# Altium schematic sheet StepTMC5160.SchDoc
size A2; SheetNumber: 1; SheetTotal: 1
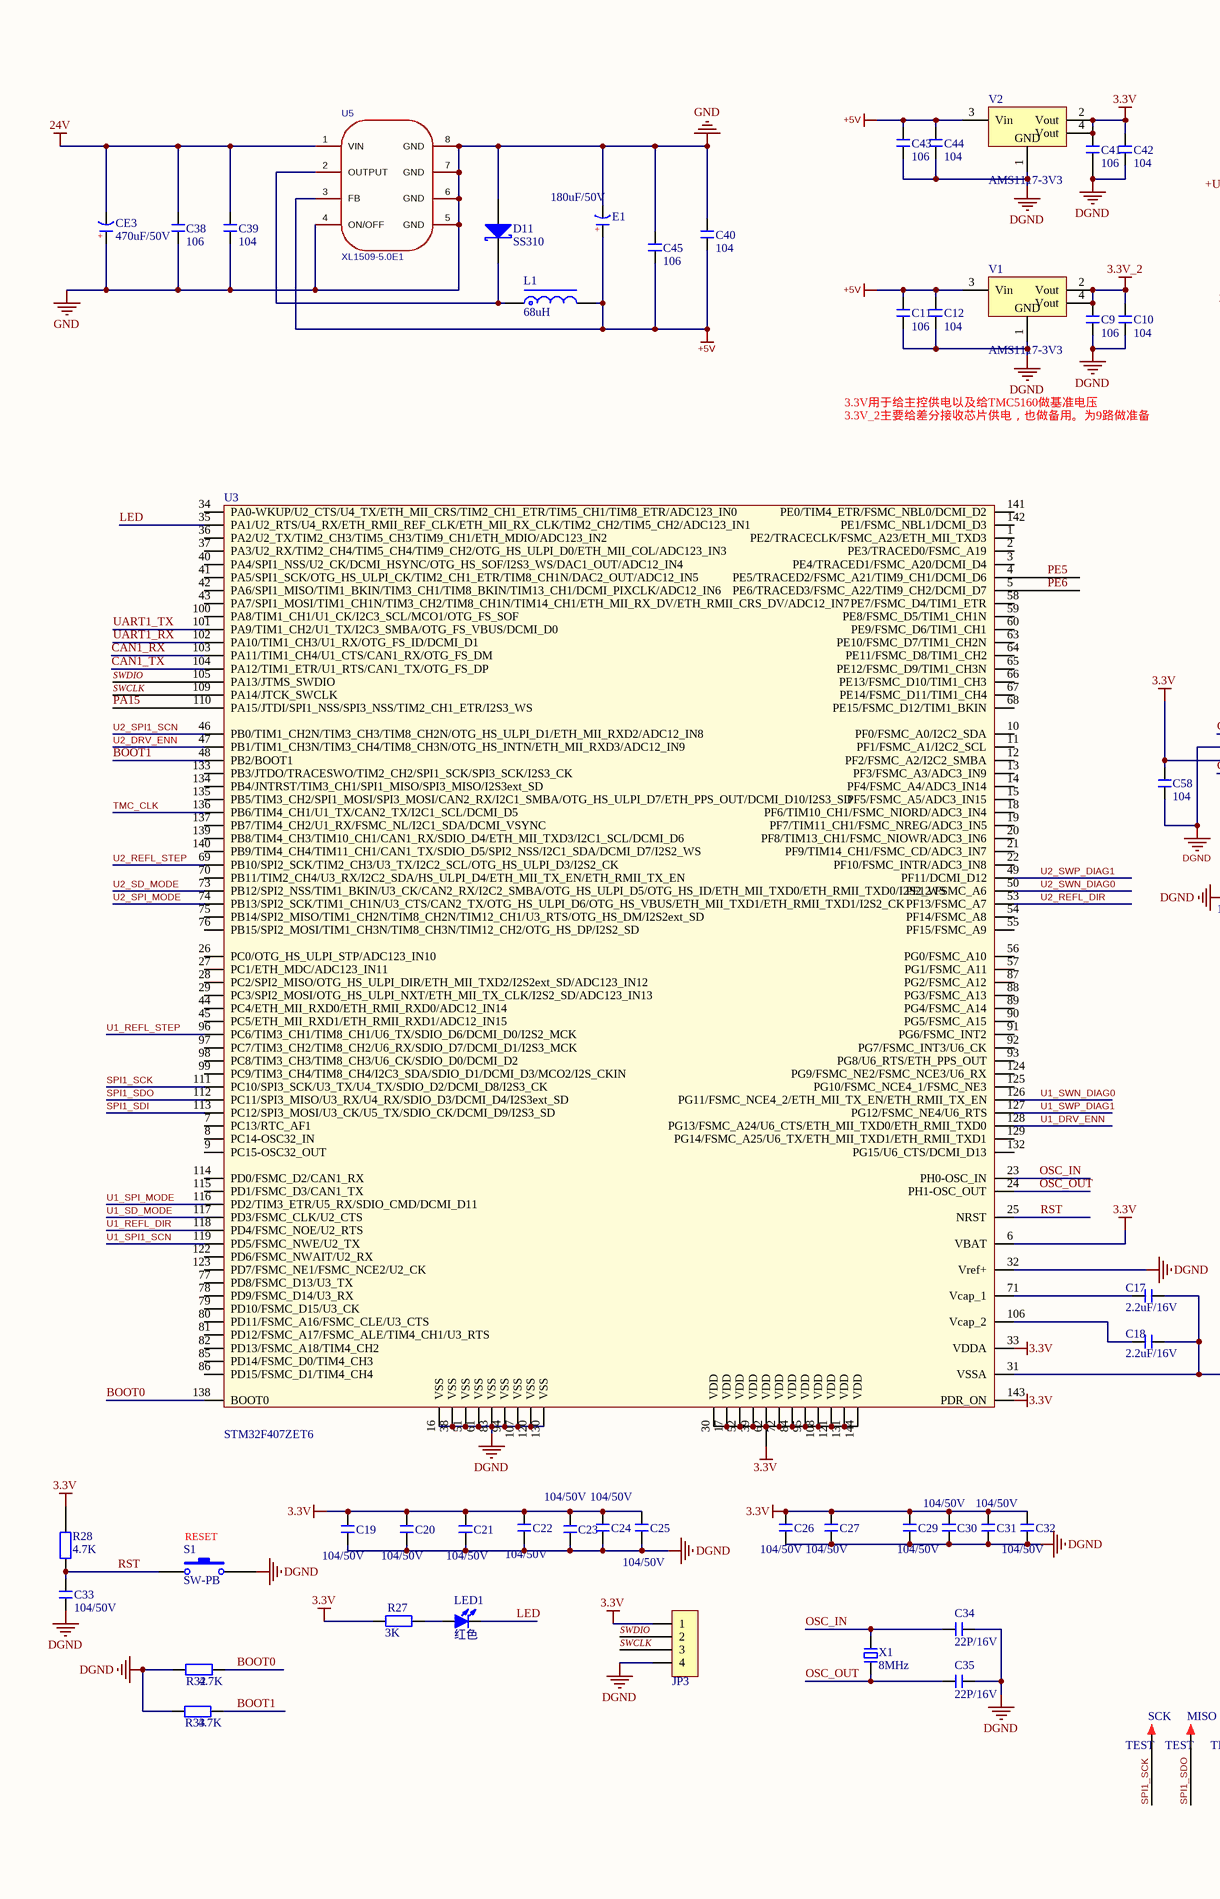
[diagram p0: StepTMC5160.SchDoc, left]
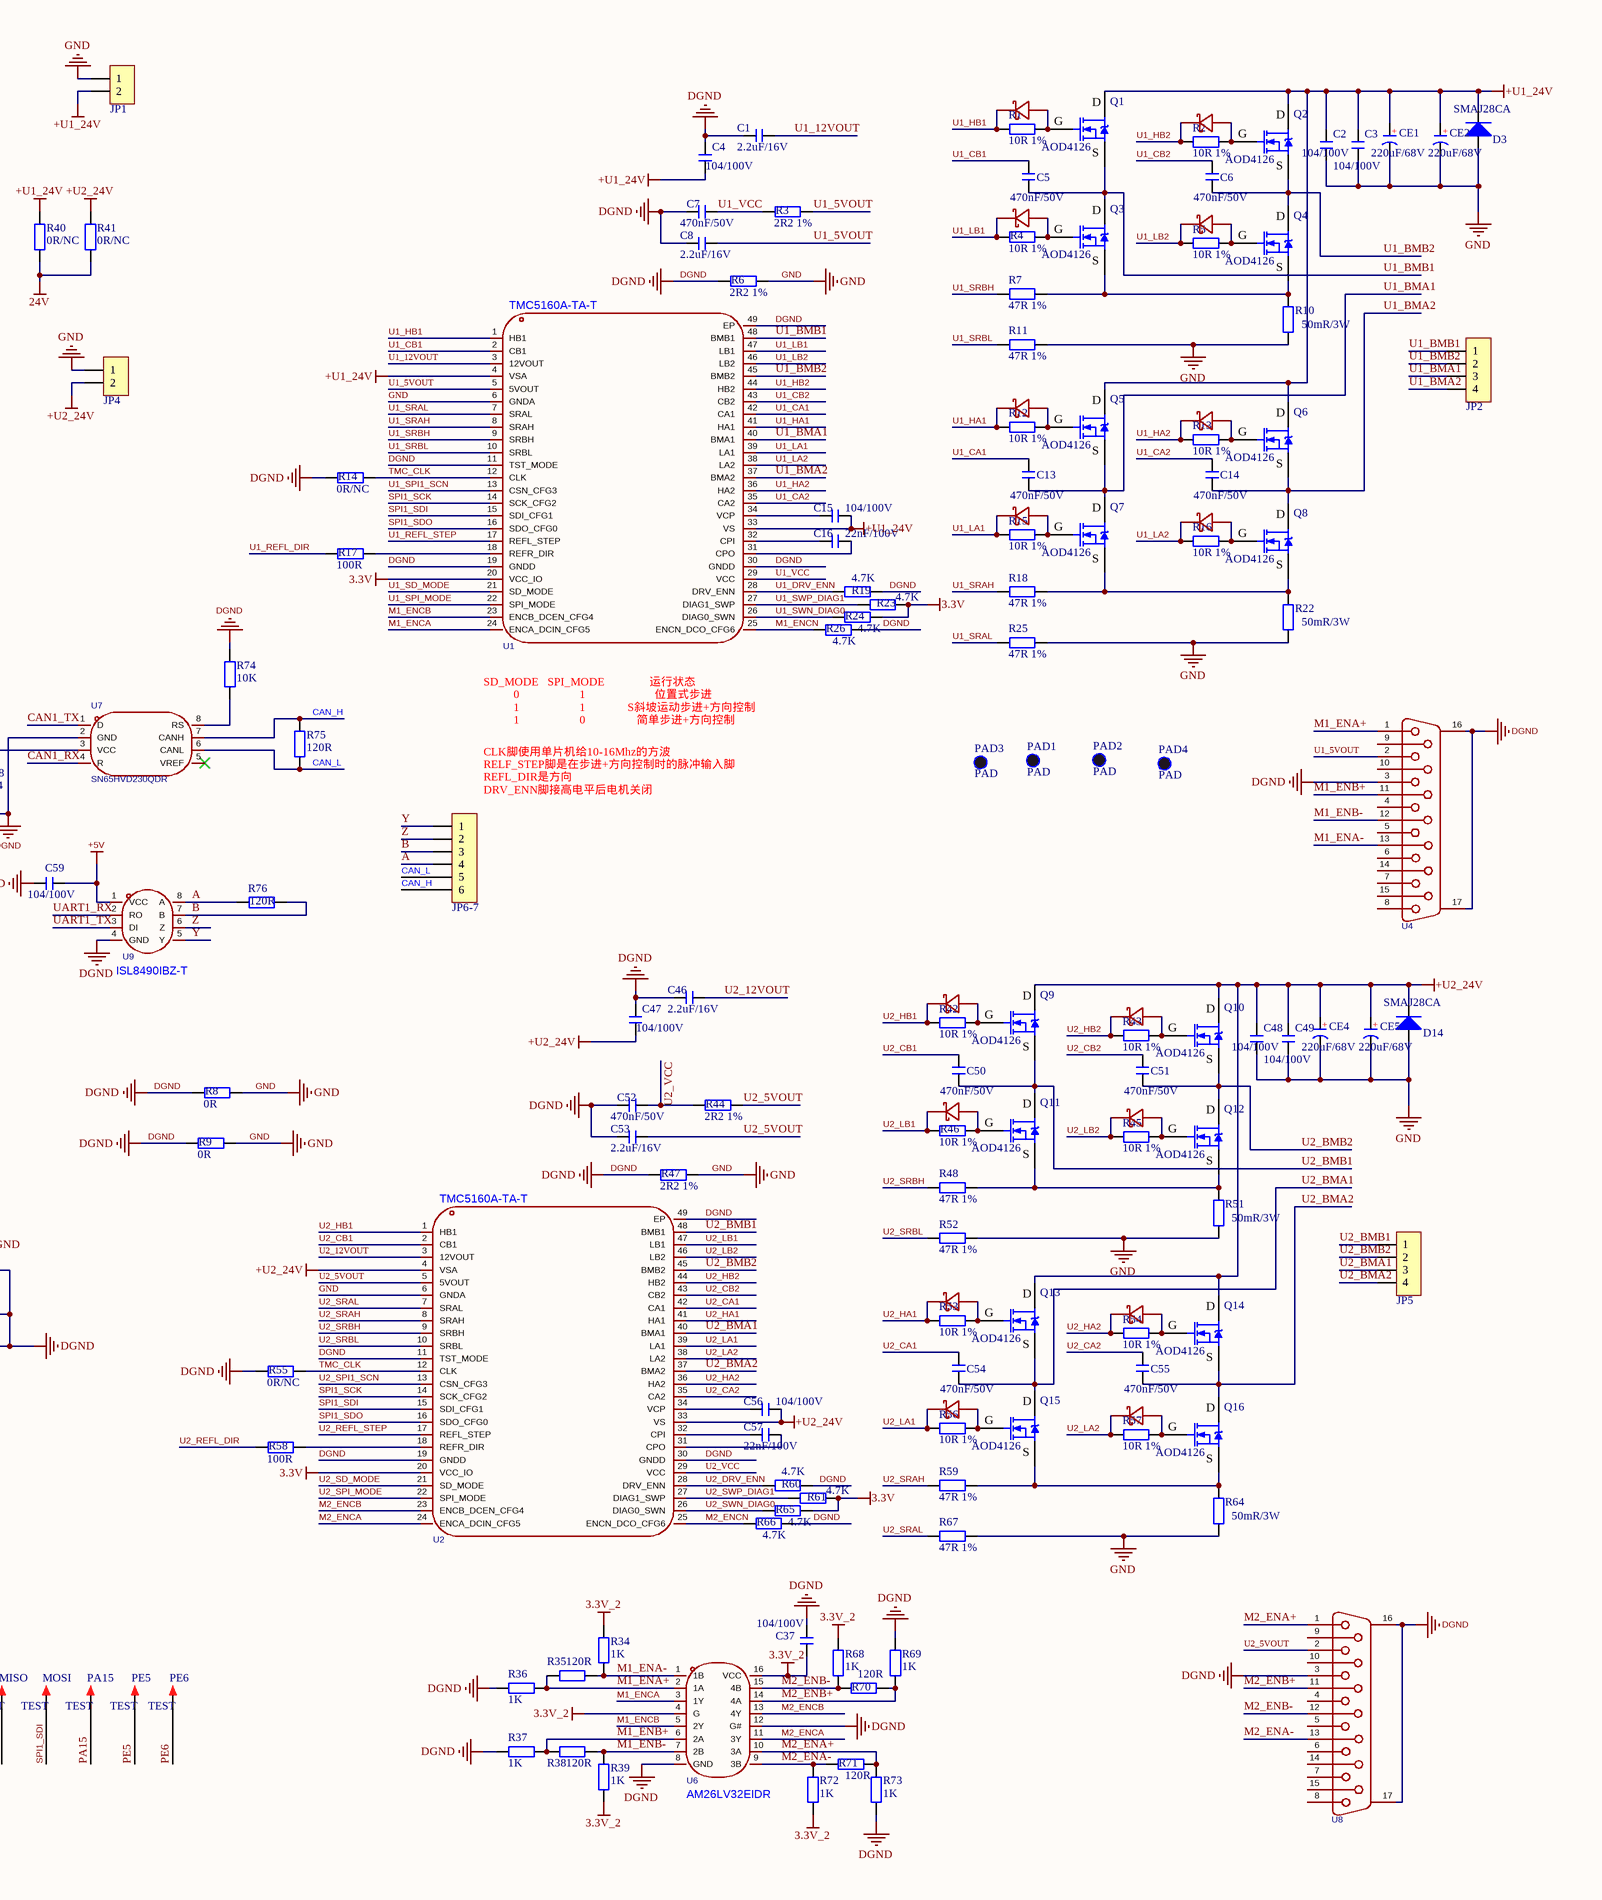
[diagram p1: StepTMC5160.SchDoc, right]

## Parts
C1  2.2uF/16V  [C 0603_L]
C2  104/100V  [C 0805_L]
C3  104/100V  [C 0805_L]
C4  104/100V  [C 0805_L]
C5  470nF/50V  [C 0603_L]
C6  470nF/50V  [C 0603_L]
C7  470nF/50V  [C 0603_L]
C8  2.2uF/16V  [C 0603_L]
C9  106  [C 0805_M]
C10  104  [C 0603_M]
C11  106  [C 0805_M]
C12  104  [C 0603_M]
C13  470nF/50V  [C 0603_L]
C14  470nF/50V  [C 0603_L]
C15  104/100V  [C 0805_L]
C16  22nF/100V  [C 0603_L]
C17  2.2uF/16V  [C 0603_L]
C18  2.2uF/16V  [C 0603_L]
C19  104/50V  [C 0603_L]
C20  104/50V  [C 0603_L]
C21  104/50V  [C 0603_L]
C22  104/50V  [C 0603_L]
C23  104/50V  [C 0603_L]
C24  104/50V  [C 0603_L]
C25  104/50V  [C 0603_L]
C26  104/50V  [C 0603_L]
C27  104/50V  [C 0603_L]
C29  104/50V  [C 0603_L]
C30  104/50V  [C 0603_L]
C31  104/50V  [C 0603_L]
C32  104/50V  [C 0603_L]
C33  104/50V  [C 0603_L]
C34  22P/16V  [C 0603_M]
C35  22P/16V  [C 0603_M]
C37  104/100V  [C 0805_L]
C38  106  [C 0805_M]
C39  104  [C 0603_M]
C40  104  [C 0603_M]
C41  106  [C 0805_M]
C42  104  [C 0603_M]
C43  106  [C 0805_M]
C44  104  [C 0603_M]
C45  106  [C 0805_M]
C46  2.2uF/16V  [C 0603_L]
C47  104/100V  [C 0805_L]
C48  104/100V  [C 0805_L]
C49  104/100V  [C 0805_L]
C50  470nF/50V  [C 0603_L]
C51  470nF/50V  [C 0603_L]
C52  470nF/50V  [C 0603_L]
C53  2.2uF/16V  [C 0603_L]
C54  470nF/50V  [C 0603_L]
C55  470nF/50V  [C 0603_L]
C56  104/100V  [C 0805_L]
C57  22nF/100V  [C 0603_L]
C58  104  [C 0603_L]
C59  104/100V  [C 0805_L]
CE1  220uF/68V  [CAP 5.0*10*12.5 - BK]
CE2  220uF/68V  [CAP 5.0*10*12.5 - BK]
CE3  470uF/50V  [CAP 5.0*10*20]
CE4  220uF/68V  [CAP 5.0*10*12.5 - BK]
CE5  220uF/68V  [CAP 5.0*10*12.5 - BK]
D1  1N4148W_C7420318  [SOD-123]  (value not drawn)
D2  1N4148W_C7420318  [SOD-123]  (value not drawn)
D3  SMAJ28CA  [DIODE-SMB]
D4  1N4148W_C7420318  [SOD-123]  (value not drawn)
D5  1N4148W_C7420318  [SOD-123]  (value not drawn)
D6  1N4148W_C7420318  [SOD-123]  (value not drawn)
D7  1N4148W_C7420318  [SOD-123]  (value not drawn)
D8  1N4148W_C7420318  [SOD-123]  (value not drawn)
D9  1N4148W_C7420318  [SOD-123]  (value not drawn)
D11  SS310  [SMA]
D12  1N4148W_C7420318  [SOD-123]  (value not drawn)
D13  1N4148W_C7420318  [SOD-123]  (value not drawn)
D14  SMAJ28CA  [DIODE-SMB]
D15  1N4148W_C7420318  [SOD-123]  (value not drawn)
D16  1N4148W_C7420318  [SOD-123]  (value not drawn)
D17  1N4148W_C7420318  [SOD-123]  (value not drawn)
D18  1N4148W_C7420318  [SOD-123]  (value not drawn)
D19  1N4148W_C7420318  [SOD-123]  (value not drawn)
D20  1N4148W_C7420318  [SOD-123]  (value not drawn)
E1  180uF/50V  [CM E(8*10.2)]
JP1  HDR-1X2  [VH3.96-LI-2P]  (value not drawn)
JP2  HDR-1X4  [KF350-4P]  (value not drawn)
JP3  HDR-1X4  [HDR2.54-LI-4P]  (value not drawn)
JP4  HDR-1X2  [VH3.96-LI-2P]  (value not drawn)
JP5  HDR-1X4  [KF350-4P]  (value not drawn)
JP6-7  HDR-1X6  [XH2.54-LI-6P]  (value not drawn)
L1  68uH  [IND-SMD_L5.7-W5.2_GSM0530]
LED1  红色  [LED 0805G]
MISO  TEST  [TEST 1.6]
MOSI  TEST  [TEST 1.6]
PA15  TEST  [TEST 1.6]
PAD1  PAD  [PAD_3.0]
PAD2  PAD  [PAD_3.0]
PAD3  PAD  [PAD_3.0]
PAD4  PAD  [PAD_3.0]
PE5  TEST  [TEST 1.6]
PE6  TEST  [TEST 1.6]
Q1  AOD4126  [TO252]
Q2  AOD4126  [TO252]
Q3  AOD4126  [TO252]
Q4  AOD4126  [TO252]
Q5  AOD4126  [TO252]
Q6  AOD4126  [TO252]
Q7  AOD4126  [TO252]
Q8  AOD4126  [TO252]
Q9  AOD4126  [TO252]
Q10  AOD4126  [TO252]
Q11  AOD4126  [TO252]
Q12  AOD4126  [TO252]
Q13  AOD4126  [TO252]
Q14  AOD4126  [TO252]
Q15  AOD4126  [TO252]
Q16  AOD4126  [TO252]
R1  10R 1%  [R 0603_L]
R2  10R 1%  [R 0603_L]
R3  2R2 1%  [R 0603_L]
R4  10R 1%  [R 0603_L]
R5  10R 1%  [R 0603_L]
R6  2R2 1%  [R 0603_L]
R7  47R 1%  [R 0603_L]
R8  0R  [R 2512_L]
R9  0R  [R 2512_L]
R10  50mR/3W  [R 2512_L]
R11  47R 1%  [R 0603_L]
R12  10R 1%  [R 0603_L]
R13  10R 1%  [R 0603_L]
R14  0R/NC  [R 0603_L]
R15  10R 1%  [R 0603_L]
R16  10R 1%  [R 0603_L]
R17  100R  [R 0603_L]
R18  47R 1%  [R 0603_L]
R19  4.7K  [R 0603_L]
R22  50mR/3W  [R 2512_L]
R23  4.7K  [R 0603_L]
R24  4.7K  [R 0603_L]
R25  47R 1%  [R 0603_L]
R26  4.7K  [R 0603_L]
R27  3K  [R 0603_L]
R28  4.7K  [R 0603_L]
R32  4.7K  [R 0603_L]
R33  4.7K  [R 0603_L]
R34  1K  [R 0603_L]
R35  120R  [R 0603_L]
R36  1K  [R 0603_L]
R37  1K  [R 0603_L]
R38  120R  [R 0603_L]
R39  1K  [R 0603_L]
R40  0R/NC  [R 0805_L]
R41  0R/NC  [R 0805_L]
R42  10R 1%  [R 0603_L]
R43  10R 1%  [R 0603_L]
R44  2R2 1%  [R 0603_L]
R45  10R 1%  [R 0603_L]
R46  10R 1%  [R 0603_L]
R47  2R2 1%  [R 0603_L]
R48  47R 1%  [R 0603_L]
R51  50mR/3W  [R 2512_L]
R52  47R 1%  [R 0603_L]
R53  10R 1%  [R 0603_L]
R54  10R 1%  [R 0603_L]
R55  0R/NC  [R 0603_L]
R56  10R 1%  [R 0603_L]
R57  10R 1%  [R 0603_L]
R58  100R  [R 0603_L]
R59  47R 1%  [R 0603_L]
R60  4.7K  [R 0603_L]
R61  4.7K  [R 0603_L]
R64  50mR/3W  [R 2512_L]
R65  4.7K  [R 0603_L]
R66  4.7K  [R 0603_L]
R67  47R 1%  [R 0603_L]
R68  1K  [R 0603_L]
R69  1K  [R 0603_L]
R70  120R  [R 0603_L]
R71  120R  [R 0603_L]
R72  1K  [R 0603_L]
R73  1K  [R 0603_L]
R74  10K  [R 0603_L]
R75  120R  [R 0603_L]
R76  120R  [R 0603_L]
S1  SW-PB  [SW_PB2_A1]
SCK  TEST  [TEST 1.6]
U1  TMC5160A-TA-T  [TQFP-48_L7.0-W7.0-P0.50-LS9.0-BL-EP]
U2  TMC5160A-TA-T  [TQFP-48_L7.0-W7.0-P0.50-LS9.0-BL-EP]
U3  STM32F407ZET6  [LQFP-144_20x20x05P]
U4  XDDB-1518-0932  [DDSUB-TH_HYC06-HDR15B-060]  (value not drawn)
U5  XL1509-5.0E1  [SOIC-8_L5.0-W4.0-P1.27-LS6.0-BL]
U6  AM26LV32EIDR  [SOIC-16_L9.9-W3.9-P1.27-LS6.0-BL]
U7  SN65HVD230QDR  [SOIC-8_L5.0-W4.0-P1.27-LS6.0-BL]
U8  XDDB-1518-0932  [DDSUB-TH_HYC06-HDR15B-060]  (value not drawn)
U9  ISL8490IBZ-T  [SOIC-8_L4.9-W3.9-P1.27-LS6.0-TL]
V1  AMS1117-3V3  [SOT223_L]
V2  AMS1117-3V3  [SOT223_L]
X1  8MHz  [OSC 6035-2P]

## Nets
3.3V: C19.2 C20.2 C21.2 C22.2 C23.2 C24.2 C25.2 C26.2 C27.2 C29.2 C30.2 C31.2 C32.2 C41.2 C42.2 C58.2 JP3.1 R23.2 R24.2 R27.2 R28.2 R61.2 R65.2 U1.20(VCC_IO) U2.20(VCC_IO) U3.6(VBAT) U3.17(VDD) U3.30(VDD) U3.33(VDDA) U3.39(VDD) U3.52(VDD) U3.62(VDD) U3.72(VDD) U3.84(VDD) U3.95(VDD) U3.108(VDD) U3.121(VDD) U3.131(VDD) U3.143(PDR_ON) U3.144(VDD) U7.3(VCC) V2.2(Vout) V2.4(Vout)
3.3V_2: C9.2 C10.2 C37.2 R34.2 R39.2 R68.2 R72.2 U6.4(G) U6.16(VCC) V1.2(Vout) V1.4(Vout)
24V: C38.2 C39.2 CE3.2(K) R40.1 R41.1 U5.1(VIN)
+5V: C11.2 C12.2 C40.1 C43.2 C44.2 C45.1 C59.1 E1.1(A) L1.2 U5.3(FB) U9.1(VCC) V1.3(Vin) V2.3(Vin)
+U1_24V: C2.2 C3.2 C4.2 C15.2 CE1.1(A) CE2.1(A) D3.2(K) JP1.2 Q1.2(D) Q2.2(D) Q5.2(D) Q6.2(D) R40.2 U1.4(VSA) U1.33(VS)
+U2_24V: C47.2 C48.2 C49.2 C56.2 CE4.1(A) CE5.1(A) D14.2(K) JP4.2 Q9.2(D) Q10.2(D) Q13.2(D) Q14.2(D) R41.2 U2.4(VSA) U2.33(VS)
DGND: C1.1 C4.1 C7.1 C8.1 C9.1 C10.1 C11.1 C12.1 C17.2 C18.2 C19.1 C20.1 C21.1 C22.1 C23.1 C24.1 C25.1 C26.1 C27.1 C29.1 C30.1 C31.1 C32.1 C33.1 C34.1 C35.1 C37.1 C41.1 C42.1 C43.1 C44.1 C46.1 C47.1 C52.1 C53.1 C58.1 C59.2 JP3.4 R6.2 R8.2 R9.2 R14.2 R19.2 R26.2 R32.1 R33.1 R36.1 R37.1 R47.2 R55.2 R60.2 R66.2 R69.1 R73.1 R74.2 S1.2 U1.11(TST_MODE) U1.19(GNDD) U1.30(GNDD) U1.49(EP) U2.11(TST_MODE) U2.19(GNDD) U2.30(GNDD) U2.49(EP) U3.16(VSS) U3.31(VSSA) U3.32(Vref+) U3.38(VSS) U3.51(VSS) U3.61(VSS) U3.83(VSS) U3.94(VSS) U3.107(VSS) U3.120(VSS) U3.130(VSS) U4.3 U4.16(MH2) U4.17(MH1) U6.8(GND) U6.12(G#) U7.2(GND) U8.3 U8.16(MH2) U8.17(MH1) U9.4(GND) V1.1(GND) V2.1(GND)
GND: C2.1 C3.1 C38.1 C39.1 C40.2 C45.2 C48.1 C49.1 CE1.2(K) CE2.2(K) CE3.1(A) CE4.2(K) CE5.2(K) D3.1(A) D11.1(A) D14.1(A) E1.2(K) JP1.1 JP4.1 R6.1 R8.1 R9.1 R10.1 R11.2 R22.1 R25.2 R47.1 R51.1 R52.2 R64.1 R67.2 U1.6(GNDA) U2.6(GNDA) U5.4(ON/OFF) U5.5(GND) U5.6(GND) U5.7(GND) U5.8(GND)
A: JP6-7.4 R76.2 U9.8(A)
B: JP6-7.3 R76.1 U9.7(B)
BOOT0: R32.2 U3.138(BOOT0)
BOOT1: R33.2 U3.48(PB2/BOOT1)
CAN1_RX: U3.103(PA11/TIM1_CH4/U1_CTS/CAN1_RX/OTG_FS_DM) U7.4(R)
CAN1_TX: U3.104(PA12/TIM1_ETR/U1_RTS/CAN1_TX/OTG_FS_DP) U7.1(D)
CAN_H: JP6-7.6 R75.2 U7.7(CANH)
CAN_L: JP6-7.5 R75.1 U7.6(CANL)
LED: LED1.2(K) U3.35(PA1/U2_RTS/U4_RX/ETH_RMII_REF_CLK/ETH_MII_RX_CLK/TIM2_CH2/TIM5_CH2/ADC123_IN1)
M1_ENA+: R35.2 R36.2 U4.1 U6.2(1A)
M1_ENA-: R34.1 R35.1 U4.13 U6.1(1B)
M1_ENB+: R37.2 R38.2 U4.11 U6.6(2A)
M1_ENB-: R38.1 R39.1 U4.12 U6.7(2B)
M1_ENCA: U1.24(ENCA_DCIN_CFG5) U6.3(1Y)
M1_ENCB: U1.23(ENCB_DCEN_CFG4) U6.5(2Y)
M1_ENCN: R26.1 U1.25(ENCN_DCO_CFG6)
M2_ENA+: R71.2 R73.2 U6.10(3A) U8.1
M2_ENA-: R71.1 R72.1 U6.9(3B) U8.13
M2_ENB+: R69.2 R70.1 U6.14(4A) U8.11
M2_ENB-: R68.1 R70.2 U6.15(4B) U8.12
M2_ENCA: U2.24(ENCA_DCIN_CFG5) U6.11(3Y)
M2_ENCB: U2.23(ENCB_DCEN_CFG4) U6.13(4Y)
M2_ENCN: R66.1 U2.25(ENCN_DCO_CFG6)
OSC_IN: C34.2 U3.23(PH0-OSC_IN) X1.2
OSC_OUT: C35.2 U3.24(PH1-OSC_OUT) X1.1
PA15: PA15.1 U3.110(PA15/JTDI/SPI1_NSS/SPI3_NSS/TIM2_CH1_ETR/I2S3_WS)
PE5: PE5.1 U3.4(PE5/TRACED2/FSMC_A21/TIM9_CH1/DCMI_D6)
PE6: PE6.1 U3.5(PE6/TRACED3/FSMC_A22/TIM9_CH2/DCMI_D7)
RST: C33.2 R28.1 S1.1 U3.25(NRST)
SPI1_SCK: SCK.1 U1.14(SCK_CFG2) U2.14(SCK_CFG2) U3.111(PC10/SPI3_SCK/U3_TX/U4_TX/SDIO_D2/DCMI_D8/I2S3_CK)
SPI1_SDI: MOSI.1 U1.15(SDI_CFG1) U2.15(SDI_CFG1) U3.113(PC12/SPI3_MOSI/U3_CK/U5_TX/SDIO_CK/DCMI_D9/I2S3_SD)
SPI1_SDO: MISO.1 U1.16(SDO_CFG0) U2.16(SDO_CFG0) U3.112(PC11/SPI3_MISO/U3_RX/U4_RX/SDIO_D3/DCMI_D4/I2S3ext_SD)
SWCLK: JP3.3 U3.109(PA14/JTCK_SWCLK)
SWDIO: JP3.2 U3.105(PA13/JTMS_SWDIO)
TMC_CLK: R14.1 R55.1 U1.12(CLK) U2.12(CLK) U3.136(PB6/TIM4_CH1/U1_TX/CAN2_TX/I2C1_SCL/DCMI_D5)
U1_5VOUT: C8.2 R3.1 U1.5(5VOUT) U4.2
U1_12VOUT: C1.2 U1.3(12VOUT)
U1_BMA1: C13.1 JP2.3 Q5.3(S) Q7.2(D) U1.40(BMA1)
U1_BMA2: C14.1 JP2.4 Q6.3(S) Q8.2(D) U1.37(BMA2)
U1_BMB1: C5.1 JP2.1 Q1.3(S) Q3.2(D) U1.48(BMB1)
U1_BMB2: C6.1 JP2.2 Q2.3(S) Q4.2(D) U1.45(BMB2)
U1_CA1: C13.2 U1.42(CA1)
U1_CA2: C14.2 U1.35(CA2)
U1_CB1: C5.2 U1.2(CB1)
U1_CB2: C6.2 U1.43(CB2)
U1_DRV_ENN: R19.1 U1.28(DRV_ENN) U3.128(PG13/FSMC_A24/U6_CTS/ETH_MII_TXD0/ETH_RMII_TXD0)
U1_HA1: D6.2(K) R12.1 U1.41(HA1)
U1_HA2: D7.2(K) R13.1 U1.36(HA2)
U1_HB1: D1.2(K) R1.1 U1.1(HB1)
U1_HB2: D2.2(K) R2.1 U1.44(HB2)
U1_LA1: D8.2(K) R15.1 U1.39(LA1)
U1_LA2: D9.2(K) R16.1 U1.38(LA2)
U1_LB1: D4.2(K) R4.1 U1.47(LB1)
U1_LB2: D5.2(K) R5.1 U1.46(LB2)
U1_REFL_DIR: R17.2 U3.118(PD4/FSMC_NOE/U2_RTS)
U1_REFL_STEP: U1.17(REFL_STEP) U3.96(PC6/TIM3_CH1/TIM8_CH1/U6_TX/SDIO_D6/DCMI_D0/I2S2_MCK)
U1_SD_MODE: U1.21(SD_MODE) U3.117(PD3/FSMC_CLK/U2_CTS)
U1_SPI1_SCN: U1.13(CSN_CFG3) U3.119(PD5/FSMC_NWE/U2_TX)
U1_SPI_MODE: U1.22(SPI_MODE) U3.116(PD2/TIM3_ETR/U5_RX/SDIO_CMD/DCMI_D11)
U1_SRAH: R18.1 U1.8(SRAH)
U1_SRAL: R25.1 U1.7(SRAL)
U1_SRBH: R7.1 U1.9(SRBH)
U1_SRBL: R11.1 U1.10(SRBL)
U1_SWN_DIAG0: R24.1 U1.26(DIAG0_SWN) U3.126(PG11/FSMC_NCE4_2/ETH_MII_TX_EN/ETH_RMII_TX_EN)
U1_SWP_DIAG1: R23.1 U1.27(DIAG1_SWP) U3.127(PG12/FSMC_NE4/U6_RTS)
U1_VCC: C7.2 R3.2 U1.29(VCC)
U2_5VOUT: C53.2 R44.1 U2.5(5VOUT) U8.2
U2_12VOUT: C46.2 U2.3(12VOUT)
U2_BMA1: C54.1 JP5.3 Q13.3(S) Q15.2(D) U2.40(BMA1)
U2_BMA2: C55.1 JP5.4 Q14.3(S) Q16.2(D) U2.37(BMA2)
U2_BMB1: C50.1 JP5.1 Q9.3(S) Q11.2(D) U2.48(BMB1)
U2_BMB2: C51.1 JP5.2 Q10.3(S) Q12.2(D) U2.45(BMB2)
U2_CA1: C54.2 U2.42(CA1)
U2_CA2: C55.2 U2.35(CA2)
U2_CB1: C50.2 U2.2(CB1)
U2_CB2: C51.2 U2.43(CB2)
U2_DRV_ENN: R60.1 U2.28(DRV_ENN) U3.47(PB1/TIM1_CH3N/TIM3_CH4/TIM8_CH3N/OTG_HS_INTN/ETH_MII_RXD3/ADC12_IN9)
U2_HA1: D17.2(K) R53.1 U2.41(HA1)
U2_HA2: D18.2(K) R54.1 U2.36(HA2)
U2_HB1: D12.2(K) R42.1 U2.1(HB1)
U2_HB2: D13.2(K) R43.1 U2.44(HB2)
U2_LA1: D19.2(K) R56.1 U2.39(LA1)
U2_LA2: D20.2(K) R57.1 U2.38(LA2)
U2_LB1: D15.2(K) R46.1 U2.47(LB1)
U2_LB2: D16.2(K) R45.1 U2.46(LB2)
U2_REFL_DIR: R58.2 U3.53(PF13/FSMC_A7)
U2_REFL_STEP: U2.17(REFL_STEP) U3.69(PB10/SPI2_SCK/TIM2_CH3/U3_TX/I2C2_SCL/OTG_HS_ULPI_D3/I2S2_CK)
U2_SD_MODE: U2.21(SD_MODE) U3.73(PB12/SPI2_NSS/TIM1_BKIN/U3_CK/CAN2_RX/I2C2_SMBA/OTG_HS_ULPI_D5/OTG_HS_ID/ETH_MII_TXD0/ETH_RMII_TXD0/I2S2_WS)
U2_SPI1_SCN: U2.13(CSN_CFG3) U3.46(PB0/TIM1_CH2N/TIM3_CH3/TIM8_CH2N/OTG_HS_ULPI_D1/ETH_MII_RXD2/ADC12_IN8)
U2_SPI_MODE: U2.22(SPI_MODE) U3.74(PB13/SPI2_SCK/TIM1_CH1N/U3_CTS/CAN2_TX/OTG_HS_ULPI_D6/OTG_HS_VBUS/ETH_MII_TXD1/ETH_RMII_TXD1/I2S2_CK)
U2_SRAH: R59.1 U2.8(SRAH)
U2_SRAL: R67.1 U2.7(SRAL)
U2_SRBH: R48.1 U2.9(SRBH)
U2_SRBL: R52.1 U2.10(SRBL)
U2_SWN_DIAG0: R65.1 U2.26(DIAG0_SWN) U3.50(PF12/FSMC_A6)
U2_SWP_DIAG1: R61.1 U2.27(DIAG1_SWP) U3.49(PF11/DCMI_D12)
U2_VCC: C52.2 R44.2 U2.29(VCC)
UART1_RX: U3.102(PA10/TIM1_CH3/U1_RX/OTG_FS_ID/DCMI_D1) U9.2(RO)
UART1_TX: U3.101(PA9/TIM1_CH2/U1_TX/I2C3_SMBA/OTG_FS_VBUS/DCMI_D0) U9.3(DI)
Y: JP6-7.1 U9.5(Y)
Z: JP6-7.2 U9.6(Z)
NetC15_1: C15.1 U1.34(VCP)
NetC16_1: C16.1 U1.32(CPI)
NetC16_2: C16.2 U1.31(CPO)
NetC17_1: C17.1 U3.71(Vcap_1)
NetC18_1: C18.1 U3.106(Vcap_2)
NetC56_1: C56.1 U2.34(VCP)
NetC57_1: C57.1 U2.32(CPI)
NetC57_2: C57.2 U2.31(CPO)
NetD1_1: D1.1(A) Q1.1(G) R1.2
NetD2_1: D2.1(A) Q2.1(G) R2.2
NetD4_1: D4.1(A) Q3.1(G) R4.2
NetD5_1: D5.1(A) Q4.1(G) R5.2
NetD6_1: D6.1(A) Q5.1(G) R12.2
NetD7_1: D7.1(A) Q6.1(G) R13.2
NetD8_1: D8.1(A) Q7.1(G) R15.2
NetD9_1: D9.1(A) Q8.1(G) R16.2
NetD11_2: D11.2(K) L1.1 U5.2(OUTPUT)
NetD12_1: D12.1(A) Q9.1(G) R42.2
NetD13_1: D13.1(A) Q10.1(G) R43.2
NetD15_1: D15.1(A) Q11.1(G) R46.2
NetD16_1: D16.1(A) Q12.1(G) R45.2
NetD17_1: D17.1(A) Q13.1(G) R53.2
NetD18_1: D18.1(A) Q14.1(G) R54.2
NetD19_1: D19.1(A) Q15.1(G) R56.2
NetD20_1: D20.1(A) Q16.1(G) R57.2
NetLED1_1: LED1.1(A) R27.1
NetQ3_3: Q3.3(S) Q4.3(S) R7.2 R10.2
NetQ7_3: Q7.3(S) Q8.3(S) R18.2 R22.2
NetQ11_3: Q11.3(S) Q12.3(S) R48.2 R51.2
NetQ15_3: Q15.3(S) Q16.3(S) R59.2 R64.2
NetR17_1: R17.1 U1.18(REFR_DIR)
NetR58_1: R58.1 U2.18(REFR_DIR)
NetR74_1: R74.1 U7.8(RS)

Not connected (* = marked no-connect by the designer): U3 1(PE2/TRACECLK/FSMC_A23/ETH_MII_TXD3) 2(PE3/TRACED0/FSMC_A19) 3(PE4/TRACED1/FSMC_A20/DCMI_D4) 7(PC13/RTC_AF1) 8(PC14-OSC32_IN) 9(PC15-OSC32_OUT) 10(PF0/FSMC_A0/I2C2_SDA) 11(PF1/FSMC_A1/I2C2_SCL) 12(PF2/FSMC_A2/I2C2_SMBA) 13(PF3/FSMC_A3/ADC3_IN9) 14(PF4/FSMC_A4/ADC3_IN14) 15(PF5/FSMC_A5/ADC3_IN15) 18(PF6/TIM10_CH1/FSMC_NIORD/ADC3_IN4) 19(PF7/TIM11_CH1/FSMC_NREG/ADC3_IN5) 20(PF8/TIM13_CH1/FSMC_NIOWR/ADC3_IN6) 21(PF9/TIM14_CH1/FSMC_CD/ADC3_IN7) 22(PF10/FSMC_INTR/ADC3_IN8) 26(PC0/OTG_HS_ULPI_STP/ADC123_IN10) 27(PC1/ETH_MDC/ADC123_IN11) 28(PC2/SPI2_MISO/OTG_HS_ULPI_DIR/ETH_MII_TXD2/I2S2ext_SD/ADC123_IN12) 29(PC3/SPI2_MOSI/OTG_HS_ULPI_NXT/ETH_MII_TX_CLK/I2S2_SD/ADC123_IN13) 34(PA0-WKUP/U2_CTS/U4_TX/ETH_MII_CRS/TIM2_CH1_ETR/TIM5_CH1/TIM8_ETR/ADC123_IN0) 36(PA2/U2_TX/TIM2_CH3/TIM5_CH3/TIM9_CH1/ETH_MDIO/ADC123_IN2) 37(PA3/U2_RX/TIM2_CH4/TIM5_CH4/TIM9_CH2/OTG_HS_ULPI_D0/ETH_MII_COL/ADC123_IN3) 40(PA4/SPI1_NSS/U2_CK/DCMI_HSYNC/OTG_HS_SOF/I2S3_WS/DAC1_OUT/ADC12_IN4) 41(PA5/SPI1_SCK/OTG_HS_ULPI_CK/TIM2_CH1_ETR/TIM8_CH1N/DAC2_OUT/ADC12_IN5) 42(PA6/SPI1_MISO/TIM1_BKIN/TIM3_CH1/TIM8_BKIN/TIM13_CH1/DCMI_PIXCLK/ADC12_IN6) 43(PA7/SPI1_MOSI/TIM1_CH1N/TIM3_CH2/TIM8_CH1N/TIM14_CH1/ETH_MII_RX_DV/ETH_RMII_CRS_DV/ADC12_IN7) 44(PC4/ETH_MII_RXD0/ETH_RMII_RXD0/ADC12_IN14) 45(PC5/ETH_MII_RXD1/ETH_RMII_RXD1/ADC12_IN15) 54(PF14/FSMC_A8) 55(PF15/FSMC_A9) 56(PG0/FSMC_A10) 57(PG1/FSMC_A11) 58(PE7/FSMC_D4/TIM1_ETR) 59(PE8/FSMC_D5/TIM1_CH1N) 60(PE9/FSMC_D6/TIM1_CH1) 63(PE10/FSMC_D7/TIM1_CH2N) 64(PE11/FSMC_D8/TIM1_CH2) 65(PE12/FSMC_D9/TIM1_CH3N) 66(PE13/FSMC_D10/TIM1_CH3) 67(PE14/FSMC_D11/TIM1_CH4) 68(PE15/FSMC_D12/TIM1_BKIN) 70(PB11/TIM2_CH4/U3_RX/I2C2_SDA/HS_ULPI_D4/ETH_MII_TX_EN/ETH_RMII_TX_EN) 75(PB14/SPI2_MISO/TIM1_CH2N/TIM8_CH2N/TIM12_CH1/U3_RTS/OTG_HS_DM/I2S2ext_SD) 76(PB15/SPI2_MOSI/TIM1_CH3N/TIM8_CH3N/TIM12_CH2/OTG_HS_DP/I2S2_SD) 77(PD8/FSMC_D13/U3_TX) 78(PD9/FSMC_D14/U3_RX) 79(PD10/FSMC_D15/U3_CK) 80(PD11/FSMC_A16/FSMC_CLE/U3_CTS) 81(PD12/FSMC_A17/FSMC_ALE/TIM4_CH1/U3_RTS) 82(PD13/FSMC_A18/TIM4_CH2) 85(PD14/FSMC_D0/TIM4_CH3) 86(PD15/FSMC_D1/TIM4_CH4) 87(PG2/FSMC_A12) 88(PG3/FSMC_A13) 89(PG4/FSMC_A14) 90(PG5/FSMC_A15) 91(PG6/FSMC_INT2) 92(PG7/FSMC_INT3/U6_CK) 93(PG8/U6_RTS/ETH_PPS_OUT) 97(PC7/TIM3_CH2/TIM8_CH2/U6_RX/SDIO_D7/DCMI_D1/I2S3_MCK) 98(PC8/TIM3_CH3/TIM8_CH3/U6_CK/SDIO_D0/DCMI_D2) 99(PC9/TIM3_CH4/TIM8_CH4/I2C3_SDA/SDIO_D1/DCMI_D3/MCO2/I2S_CKIN) 100(PA8/TIM1_CH1/U1_CK/I2C3_SCL/MCO1/OTG_FS_SOF) 114(PD0/FSMC_D2/CAN1_RX) 115(PD1/FSMC_D3/CAN1_TX) 122(PD6/FSMC_NWAIT/U2_RX) 123(PD7/FSMC_NE1/FSMC_NCE2/U2_CK) 124(PG9/FSMC_NE2/FSMC_NCE3/U6_RX) 125(PG10/FSMC_NCE4_1/FSMC_NE3) 129(PG14/FSMC_A25/U6_TX/ETH_MII_TXD1/ETH_RMII_TXD1) 132(PG15/U6_CTS/DCMI_D13) 133(PB3/JTDO/TRACESWO/TIM2_CH2/SPI1_SCK/SPI3_SCK/I2S3_CK) 134(PB4/JNTRST/TIM3_CH1/SPI1_MISO/SPI3_MISO/I2S3ext_SD) 135(PB5/TIM3_CH2/SPI1_MOSI/SPI3_MOSI/CAN2_RX/I2C1_SMBA/OTG_HS_ULPI_D7/ETH_PPS_OUT/DCMI_D10/I2S3_SD) 137(PB7/TIM4_CH2/U1_RX/FSMC_NL/I2C1_SDA/DCMI_VSYNC) 139(PB8/TIM4_CH3/TIM10_CH1/CAN1_RX/SDIO_D4/ETH_MII_TXD3/I2C1_SCL/DCMI_D6) 140(PB9/TIM4_CH4/TIM11_CH1/CAN1_TX/SDIO_D5/SPI2_NSS/I2C1_SDA/DCMI_D7/I2S2_WS) 141(PE0/TIM4_ETR/FSMC_NBL0/DCMI_D2) 142(PE1/FSMC_NBL1/DCMI_D3); U4 4 5 6 7 8 9 10 14 15; U7 5(VREF)*; U8 4 5 6 7 8 9 10 14 15

## Notes on the sheet
- 3.3V用于给主控供电以及给TMC5160做基准电压
  3.3V_2主要给差分接收芯片供电，也做备用。为9路做准备
- (near U1) SD_MODE   SPI_MODE               运行状态
  0                    1                       位置式步进
  1                    1              S斜坡运动步进+方向控制
  1                    0                 简单步进+方向控制
- (near JP6-7) CLK脚使用单片机给10-16Mhz的方波
  RELF_STEP脚是在步进+方向控制时的脉冲输入脚
  REFL_DIR是方向
  DRV_ENN脚接高电平后电机关闭
- (near S1) RESET
- (in symbol CE) +
- (in symbol CE_SMD) +

## Library data of the parts
C1-C27 C29-C35 C37-C59 = C: 贴片电容; BOM名称: 无极性贴片电容; 淘宝ID: 封装库来自淘宝 ID：黄晶宝石; 联系售后，技术支持: https://shop463601444.taobao.com; 唯一出售店铺网址: https://shop463601444.taobao.com
CE1-CE5 = CE: 直插电解电容; 淘宝ID: 封装库来自淘宝 ID：黄晶宝石; BOM名称: 直插电解电容; 联系售后: https://shop463601444.taobao.com
D3 D14 = TVS: TVS保护; Type: E6.8CA; Published: 8-Jun-2000; LatestRevisionDate: 17-Jul-2002; LatestRevisionNote: Re-released for DXP Platform.; PackageDocument: Sep-1996; PackageReference: SMC; Publisher: Altium Limited; Code_JEDEC: DO-214-AB
D11 = SS34: 肖特基二极管; 属性: 40V/3A; BOM名称: 肖特基二极管; 封装库来自淘宝 ID：黄晶宝石: https://shop463601444.taobao.com
E1 = CE_SMD: 贴片电解电容; 版权归属: 封装库来自淘宝 ID：黄晶宝石; BOM名称: 贴片电解电容; 联系售后: https://shop463601444.taobao.com
JP1 JP4 = Header 2: 2P接插件; 版权归属: 封装库来自淘宝卖家 ID：黄晶宝石; BOM名称: 2P接插件; 学习资源: https://shop463601444.taobao.com
JP2 JP5 = Header 4: 4P接插件; 版权归属: 封装库来自淘宝卖家 ID：黄晶宝石; BOM名称: 4P接插件; 学习资源: https://shop463601444.taobao.com
JP3 = Header 4: 4P接插件; 版权归属: 封装库来自淘宝 ID：黄晶宝石; BOM名称: 4P接插件; 学习资源: https://shop463601444.taobao.com
JP6-7 = Header 6: 6P接插件; 版权归属: 封装库来自淘宝 ID：黄晶宝石; BOM名称: 6P接插件; 学习资源: https://shop463601444.taobao.com
L1 = L-CDRH: 功率屏蔽电感; 版权归属: 封装库来自淘宝 ID：黄晶宝石; BOM名称: 功率屏蔽电感; 联系售后: https://shop463601444.taobao.com
LED1 = LED-SMD: 贴片LED; 版权归属: 封装库来自淘宝 ID：黄晶宝石; BOM名称: 贴片LED; 学习资源: https://shop463601444.taobao.com
MISO MOSI PA15 PE5 PE6 SCK = TEST: 测试点; 版权归属: 封装库来自淘宝 ID：黄晶宝石; BOM名称: 测试点; 学习资源: https://shop463601444.taobao.com
PAD1-PAD4 = PAD: 固定用途的焊盘
Q1-Q16 = 2SK3615: N沟场效应管; 技术支持，联系售后: 其他店铺购入均为盗版，不享受售后技术支持服务，请立即申请退款; BOM名称: N沟场效应管; 学习资源: https://shop463601444.taobao.com
R1-R19 R22-R28 R32-R48 R51-R61 R64-R76 = R: 贴片电阻; 版权归属: 来自淘宝 ID：黄晶宝石; 封装库来自淘宝卖家 ID：黄晶宝石: 其他店铺购入均为盗版，不享受售后技术支持服务，请立即申请退款; BOM名称: 贴片电阻; 联系售后: https://shop463601444.taobao.com
S1 = SW-PB: 微动开关; Published: 24-Mar-1999; LatestRevisionDate: 17-Jul-2002; LatestRevisionNote: Re-released for DXP Platform.; PackageReference: SPST-2; Publisher: Altium Limited
U5 = XL1509-5.0E1: 功能类型:降压型;工作电压:4.5V~40V;输出电压:5V;输出电流:2A;输出类型:固定;; Manufacturer: XLSEMI(芯龙); AddInBom: yes; ModelId: 7abc64c95a1a4a04a4ef38f9097c870b聨0819f05c4eef4c71ace90d822a990e87; ModelTransform: 192.913,236.22,0,0,0,0,0,0,0; Function: 降压型; Output Voltage: 5V; Output Current: 2A; Frequency - Switching: 150kHz; Synchronous Rectifier: 否; Number of Outputs: 1; Topology: 降压式; Quiescent Current: 2mA; Switch tube (built-in/external): 内置; Output Type: 固定; Symbol: XL1509-5.0E1; Device: XL1509-5.0E1; LCSC Part Name: 2A 150KHz 40V 降压 DC-DC 转换器; SupplierPart: C61063; ManufacturerPart: XL1509-5.0E1; Supplier Footprint: SOIC-8; JLCPCB Part Class: Basic Part; Datasheet: https://item.szlcsc.com/datasheet/XL1509-5.0E1/62115.html; Supplier: LCSC; ConvertToPcb: yes; FootprintName: SOIC-8_L5.0-W4.0-P1.27-LS6.0-BL; ModelName: SOIC-8_L5.0-W4.0-P1.27-LS6.0-BL; Voltage - Supply: 4.5V~40V; Operating Temperature: -40℃~+85℃
U7 = SN65HVD230QDR: 类型:CAN收发器;数据速率:1Mbps;; Manufacturer: TI(德州仪器); 3D Model: 7abc64c95a1a4a04a4ef38f9097c870b聨0819f05c4eef4c71ace90d822a990e87; 3D Model Transform: 192.913,236.22,0,0,0,0,0,0,0; Data Rate: 1Mbps; Voltage - Supply: 3V~3.6V; Current - Supply: 17mA; Quiescent Supply Current: 370uA; AddInBom: yes; Symbol: SN65HVD230QDR; Device: SN65HVD230QDR; LCSC Part Name: SN65HVD230Q-Q1 CAN收发器; Supplier Part: C16468; Manufacturer Part: SN65HVD230QDR; Supplier Footprint: SOIC-8; JLCPCB Part Class: Extended Part; Datasheet: https://www.ti.com/cn/lit/gpn/sn65hvd230q; Supplier: LCSC; Type: CAN收发器; Operating Temperature: -40℃~+125℃; Number of Channels: -; ConvertToPcb: yes; FootprintName: SOIC-8_L5.0-W4.0-P1.27-LS6.0-BL; ModelName: SOIC-8_L5.0-W4.0-P1.27-LS6.0-BL
V1 V2 = AMS1117: 三端稳压芯片; BOM名称: 稳压芯片; 淘宝ID: 封装库来自淘宝 ID：黄晶宝石; 欢迎光临淘宝店铺: https://shop463601444.taobao.com
X1 = XTAL-2P: 2脚无源脚晶振; 版权归属: 封装库来自淘宝卖家 ID：黄晶宝石; BOM名称: 2脚无源脚晶振; 学习资源: https://shop463601444.taobao.com
D1 D2 D4-D9 D12 D13 D15-D20 = 1N4148W_C7420318: Symbol: 1N4148W_C7420318
U1 U2 = TMC5160A-TA-T: Symbol: TMC5160A-TA-T
U4 U8 = XDDB-1518-0932: Symbol: XDDB-1518-0932
U6 = AM26LV32EIDR: Symbol: AM26LV32EIDR
U9 = ISL8490IBZ-T: Symbol: ISL8490IBZ-T